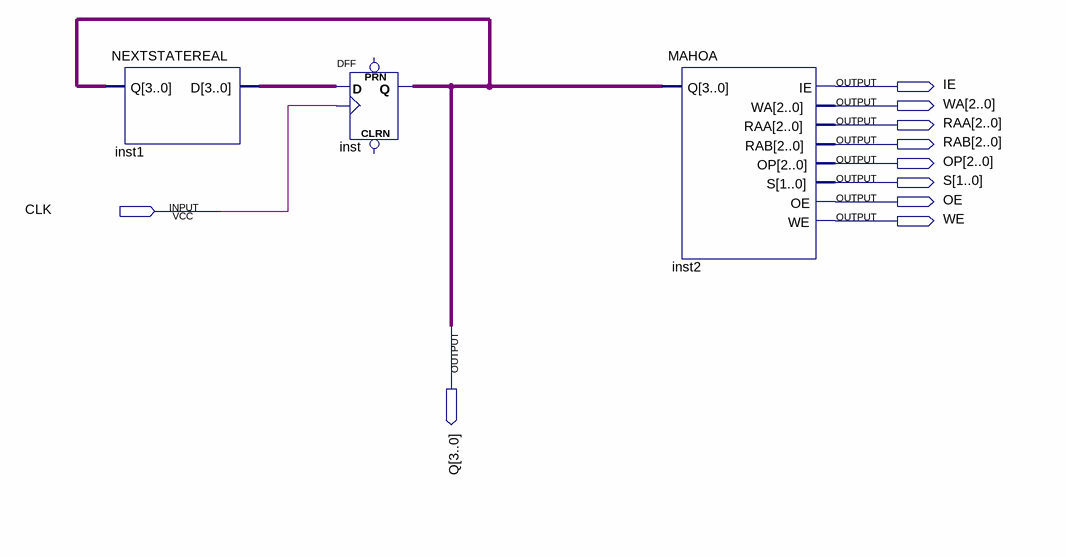
[diagram p0: schematic sheet]
// Quartus schematic CONTROLLER.bdf as structural Verilog: 3 symbols, 10 pins
module CONTROLLER (
  input  CLK,
  output IE,
  output [2:0] WA,
  output [2:0] RAA,
  output [2:0] RAB,
  output [2:0] OP,
  output [1:0] S,
  output OE,
  output WE,
  output [3:0] Q
);

  wire [3:0] inst1_d;

  NEXTSTATEREAL inst1 (.Q(Q), .D(inst1_d));
  DFF inst[3:0] (.CLK(CLK), .D(inst1_d), .Q(Q));  // open: CLRN, PRN
  MAHOA inst2 (.Q(Q), .IE(IE), .WA(WA), .RAA(RAA), .RAB(RAB), .OP(OP), .S(S), .OE(OE), .WE(WE));
endmodule
